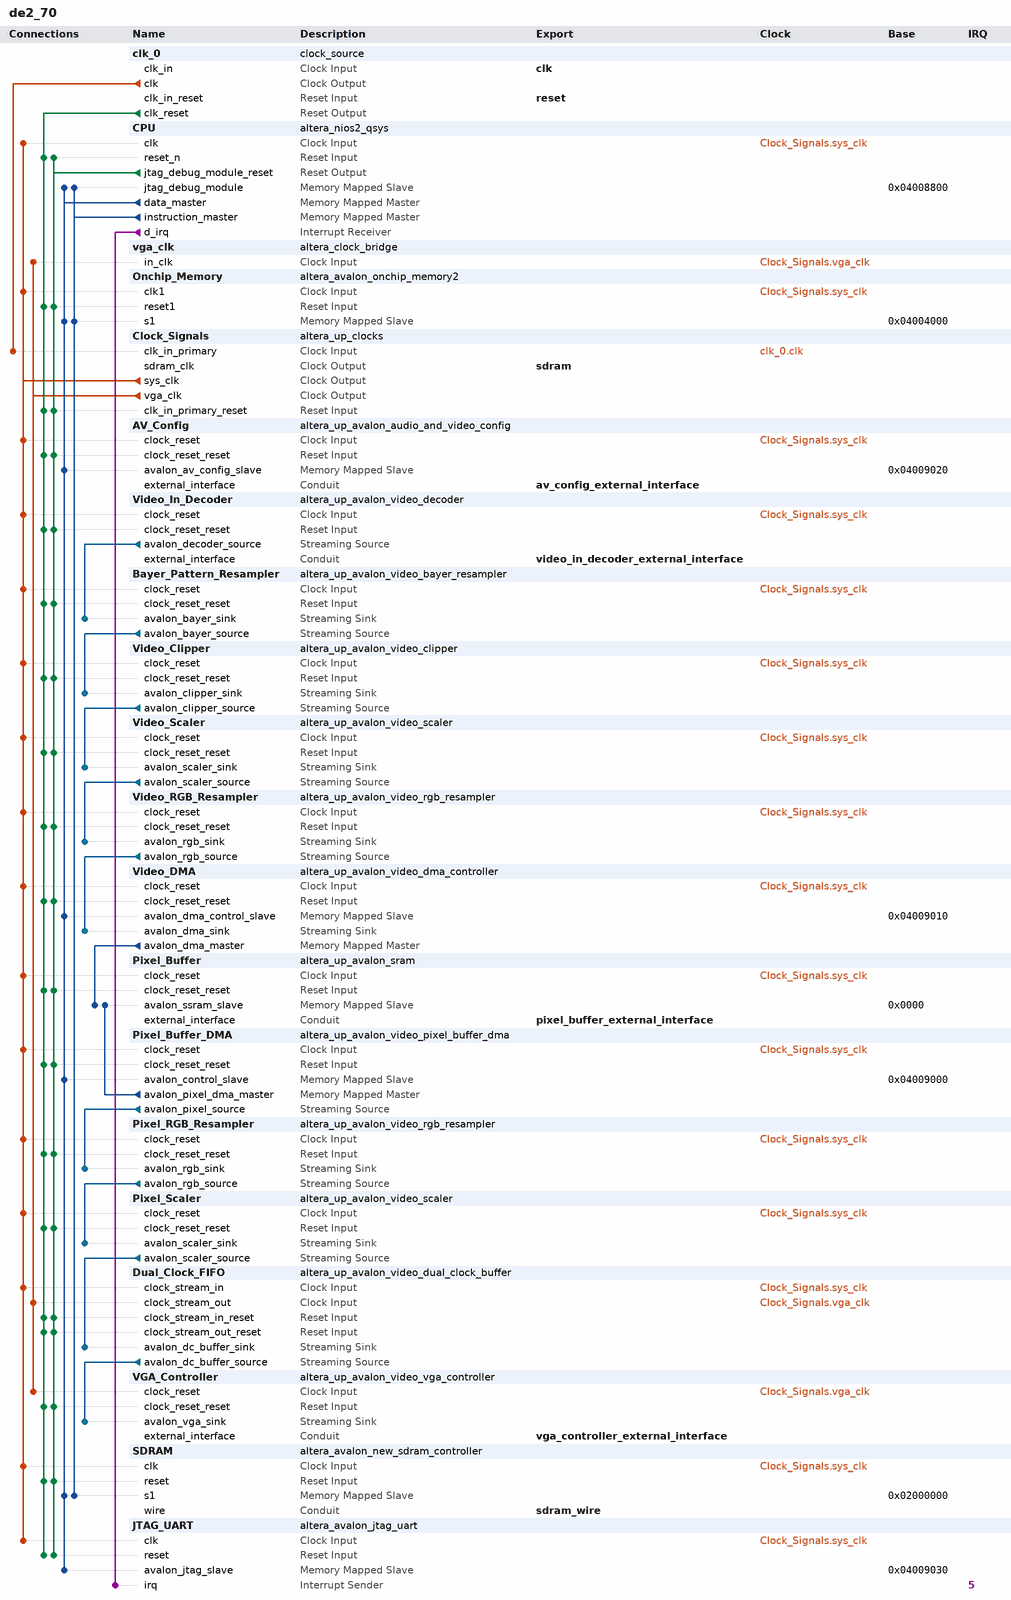
[diagram p0: system contents]
# Platform Designer (Qsys) system de2_70, Cyclone II EP2C70F896C6
# Parameters at their usual value, and those the tool derives, are not listed.
package require -exact qsys 13.0
create_system de2_70
set_project_property DEVICE_FAMILY {Cyclone II}
set_project_property DEVICE EP2C70F896C6

add_instance clk_0 clock_source 13.0
set_instance_parameter_value clk_0 clockFrequency 50000000

add_instance CPU altera_nios2_qsys 13.0
set_instance_parameter_value CPU resetSlave SDRAM.s1
set_instance_parameter_value CPU mmu_TLBMissExcSlave None
set_instance_parameter_value CPU exceptionSlave SDRAM.s1
set_instance_parameter_value CPU breakSlave CPU.jtag_debug_module
set_instance_parameter_value CPU impl Tiny
set_instance_parameter_value CPU icache_size 4096

add_instance vga_clk altera_clock_bridge 13.0
set_instance_parameter_value vga_clk DERIVED_CLOCK_RATE 25000000
set_instance_parameter_value vga_clk EXPLICIT_CLOCK_RATE 0

add_instance Onchip_Memory altera_avalon_onchip_memory2 13.0.1.99.2
set_instance_parameter_value Onchip_Memory dataWidth 32
set_instance_parameter_value Onchip_Memory dualPort false
set_instance_parameter_value Onchip_Memory initMemContent true
set_instance_parameter_value Onchip_Memory initializationFileName onchip_mem.hex
set_instance_parameter_value Onchip_Memory memorySize 16384

add_instance Clock_Signals altera_up_clocks 13.0
set_instance_parameter_value Clock_Signals board DE2-70
set_instance_parameter_value Clock_Signals vga_clk true
set_instance_parameter_value Clock_Signals audio_clk false
set_instance_parameter_value Clock_Signals audio_clk_freq 12.288

add_instance AV_Config altera_up_avalon_audio_and_video_config 13.0
set_instance_parameter_value AV_Config board DE2-70
set_instance_parameter_value AV_Config audio_in {Microphone to ADC}
set_instance_parameter_value AV_Config line_in_bypass false
set_instance_parameter_value AV_Config bit_length 24
set_instance_parameter_value AV_Config sampling_rate {48 kHz}

add_instance Video_In_Decoder altera_up_avalon_video_decoder 13.0
set_instance_parameter_value Video_In_Decoder video_source {5MP Daughtercard (THDB_D5M)}

add_instance Bayer_Pattern_Resampler altera_up_avalon_video_bayer_resampler 13.0
set_instance_parameter_value Bayer_Pattern_Resampler use_custom_format true
set_instance_parameter_value Bayer_Pattern_Resampler custom_width_in 2592
set_instance_parameter_value Bayer_Pattern_Resampler custom_height_in 1944

add_instance Video_Clipper altera_up_avalon_video_clipper 13.0
set_instance_parameter_value Video_Clipper width_in 1296
set_instance_parameter_value Video_Clipper height_in 972
set_instance_parameter_value Video_Clipper drop_left 8
set_instance_parameter_value Video_Clipper drop_right 8
set_instance_parameter_value Video_Clipper drop_top 6
set_instance_parameter_value Video_Clipper drop_bottom 6
set_instance_parameter_value Video_Clipper color_bits 8
set_instance_parameter_value Video_Clipper color_planes 3

add_instance Video_Scaler altera_up_avalon_video_scaler 13.0
set_instance_parameter_value Video_Scaler width_scaling 0.5
set_instance_parameter_value Video_Scaler height_scaling 0.25
set_instance_parameter_value Video_Scaler width_in 1280
set_instance_parameter_value Video_Scaler height_in 960
set_instance_parameter_value Video_Scaler color_bits 8
set_instance_parameter_value Video_Scaler color_planes 3

add_instance Video_RGB_Resampler altera_up_avalon_video_rgb_resampler 13.0
set_instance_parameter_value Video_RGB_Resampler input_type {24-bit RGB}
set_instance_parameter_value Video_RGB_Resampler output_type {16-bit RGB}
set_instance_parameter_value Video_RGB_Resampler alpha 1023

add_instance Video_DMA altera_up_avalon_video_dma_controller 13.0
set_instance_parameter_value Video_DMA mode {From Stream to Memory}
set_instance_parameter_value Video_DMA addr_mode X-Y
set_instance_parameter_value Video_DMA start_address 0
set_instance_parameter_value Video_DMA back_start_address 0
set_instance_parameter_value Video_DMA width 640
set_instance_parameter_value Video_DMA height 240
set_instance_parameter_value Video_DMA color_bits 16
set_instance_parameter_value Video_DMA color_planes 1
set_instance_parameter_value Video_DMA dma_enabled true

add_instance Pixel_Buffer altera_up_avalon_sram 13.0
set_instance_parameter_value Pixel_Buffer board DE2-70
set_instance_parameter_value Pixel_Buffer pixel_buffer true

add_instance Pixel_Buffer_DMA altera_up_avalon_video_pixel_buffer_dma 13.0
set_instance_parameter_value Pixel_Buffer_DMA addr_mode X-Y
set_instance_parameter_value Pixel_Buffer_DMA start_address 0
set_instance_parameter_value Pixel_Buffer_DMA back_start_address 0
set_instance_parameter_value Pixel_Buffer_DMA image_width 640
set_instance_parameter_value Pixel_Buffer_DMA image_height 240
set_instance_parameter_value Pixel_Buffer_DMA color_space {16-bit RGB}

add_instance Pixel_RGB_Resampler altera_up_avalon_video_rgb_resampler 13.0
set_instance_parameter_value Pixel_RGB_Resampler input_type {16-bit RGB}
set_instance_parameter_value Pixel_RGB_Resampler output_type {30-bit RGB}
set_instance_parameter_value Pixel_RGB_Resampler alpha 1023

add_instance Pixel_Scaler altera_up_avalon_video_scaler 13.0
set_instance_parameter_value Pixel_Scaler width_scaling 1
set_instance_parameter_value Pixel_Scaler height_scaling 2
set_instance_parameter_value Pixel_Scaler width_in 640
set_instance_parameter_value Pixel_Scaler color_bits 10
set_instance_parameter_value Pixel_Scaler color_planes 3

add_instance Dual_Clock_FIFO altera_up_avalon_video_dual_clock_buffer 13.0
set_instance_parameter_value Dual_Clock_FIFO color_bits 10

add_instance VGA_Controller altera_up_avalon_video_vga_controller 13.0
set_instance_parameter_value VGA_Controller board DE2-70

add_instance SDRAM altera_avalon_new_sdram_controller 13.0.1.99.2
set_instance_parameter_value SDRAM TAC 5.5
set_instance_parameter_value SDRAM TRCD 20.0
set_instance_parameter_value SDRAM TRP 20.0
set_instance_parameter_value SDRAM casLatency 3
set_instance_parameter_value SDRAM columnWidth 9
set_instance_parameter_value SDRAM dataWidth 16
set_instance_parameter_value SDRAM generateSimulationModel false
set_instance_parameter_value SDRAM model single_Micron_MT48LC4M32B2_7_chip
set_instance_parameter_value SDRAM numberOfBanks 4
set_instance_parameter_value SDRAM numberOfChipSelects 1
set_instance_parameter_value SDRAM powerUpDelay 200.0
set_instance_parameter_value SDRAM refreshPeriod 7.8125
set_instance_parameter_value SDRAM rowWidth 13

add_instance JTAG_UART altera_avalon_jtag_uart 13.0.1.99.2
set_instance_parameter_value JTAG_UART simInteractiveOptions NO_INTERACTIVE_WINDOWS

# connections
add_connection clk_0.clk Clock_Signals.clk_in_primary clock
add_connection Clock_Signals.sys_clk AV_Config.clock_reset clock
add_connection Clock_Signals.sys_clk Bayer_Pattern_Resampler.clock_reset clock
add_connection Clock_Signals.sys_clk CPU.clk clock
add_connection Clock_Signals.sys_clk Dual_Clock_FIFO.clock_stream_in clock
add_connection Clock_Signals.sys_clk JTAG_UART.clk clock
add_connection Clock_Signals.sys_clk Onchip_Memory.clk1 clock
add_connection Clock_Signals.sys_clk Pixel_Buffer.clock_reset clock
add_connection Clock_Signals.sys_clk Pixel_Buffer_DMA.clock_reset clock
add_connection Clock_Signals.sys_clk Pixel_RGB_Resampler.clock_reset clock
add_connection Clock_Signals.sys_clk Pixel_Scaler.clock_reset clock
add_connection Clock_Signals.sys_clk SDRAM.clk clock
add_connection Clock_Signals.sys_clk Video_Clipper.clock_reset clock
add_connection Clock_Signals.sys_clk Video_DMA.clock_reset clock
add_connection Clock_Signals.sys_clk Video_In_Decoder.clock_reset clock
add_connection Clock_Signals.sys_clk Video_RGB_Resampler.clock_reset clock
add_connection Clock_Signals.sys_clk Video_Scaler.clock_reset clock
add_connection Clock_Signals.vga_clk Dual_Clock_FIFO.clock_stream_out clock
add_connection Clock_Signals.vga_clk vga_clk.in_clk clock
add_connection Clock_Signals.vga_clk VGA_Controller.clock_reset clock
add_connection clk_0.clk_reset AV_Config.clock_reset_reset reset
add_connection clk_0.clk_reset Bayer_Pattern_Resampler.clock_reset_reset reset
add_connection clk_0.clk_reset Clock_Signals.clk_in_primary_reset reset
add_connection clk_0.clk_reset CPU.reset_n reset
add_connection clk_0.clk_reset Dual_Clock_FIFO.clock_stream_in_reset reset
add_connection clk_0.clk_reset Dual_Clock_FIFO.clock_stream_out_reset reset
add_connection clk_0.clk_reset JTAG_UART.reset reset
add_connection clk_0.clk_reset Onchip_Memory.reset1 reset
add_connection clk_0.clk_reset Pixel_Buffer.clock_reset_reset reset
add_connection clk_0.clk_reset Pixel_Buffer_DMA.clock_reset_reset reset
add_connection clk_0.clk_reset Pixel_RGB_Resampler.clock_reset_reset reset
add_connection clk_0.clk_reset Pixel_Scaler.clock_reset_reset reset
add_connection clk_0.clk_reset SDRAM.reset reset
add_connection clk_0.clk_reset VGA_Controller.clock_reset_reset reset
add_connection clk_0.clk_reset Video_Clipper.clock_reset_reset reset
add_connection clk_0.clk_reset Video_DMA.clock_reset_reset reset
add_connection clk_0.clk_reset Video_In_Decoder.clock_reset_reset reset
add_connection clk_0.clk_reset Video_RGB_Resampler.clock_reset_reset reset
add_connection clk_0.clk_reset Video_Scaler.clock_reset_reset reset
add_connection CPU.jtag_debug_module_reset AV_Config.clock_reset_reset reset
add_connection CPU.jtag_debug_module_reset Bayer_Pattern_Resampler.clock_reset_reset reset
add_connection CPU.jtag_debug_module_reset Clock_Signals.clk_in_primary_reset reset
add_connection CPU.jtag_debug_module_reset CPU.reset_n reset
add_connection CPU.jtag_debug_module_reset Dual_Clock_FIFO.clock_stream_in_reset reset
add_connection CPU.jtag_debug_module_reset Dual_Clock_FIFO.clock_stream_out_reset reset
add_connection CPU.jtag_debug_module_reset JTAG_UART.reset reset
add_connection CPU.jtag_debug_module_reset Onchip_Memory.reset1 reset
add_connection CPU.jtag_debug_module_reset Pixel_Buffer.clock_reset_reset reset
add_connection CPU.jtag_debug_module_reset Pixel_Buffer_DMA.clock_reset_reset reset
add_connection CPU.jtag_debug_module_reset Pixel_RGB_Resampler.clock_reset_reset reset
add_connection CPU.jtag_debug_module_reset Pixel_Scaler.clock_reset_reset reset
add_connection CPU.jtag_debug_module_reset SDRAM.reset reset
add_connection CPU.jtag_debug_module_reset VGA_Controller.clock_reset_reset reset
add_connection CPU.jtag_debug_module_reset Video_Clipper.clock_reset_reset reset
add_connection CPU.jtag_debug_module_reset Video_DMA.clock_reset_reset reset
add_connection CPU.jtag_debug_module_reset Video_In_Decoder.clock_reset_reset reset
add_connection CPU.jtag_debug_module_reset Video_RGB_Resampler.clock_reset_reset reset
add_connection CPU.jtag_debug_module_reset Video_Scaler.clock_reset_reset reset
add_connection CPU.data_master AV_Config.avalon_av_config_slave avalon
set_connection_parameter_value CPU.data_master/AV_Config.avalon_av_config_slave baseAddress 0x04009020
add_connection CPU.data_master CPU.jtag_debug_module avalon
set_connection_parameter_value CPU.data_master/CPU.jtag_debug_module baseAddress 0x04008800
add_connection CPU.data_master JTAG_UART.avalon_jtag_slave avalon
set_connection_parameter_value CPU.data_master/JTAG_UART.avalon_jtag_slave baseAddress 0x04009030
add_connection CPU.data_master Onchip_Memory.s1 avalon
set_connection_parameter_value CPU.data_master/Onchip_Memory.s1 baseAddress 0x04004000
add_connection CPU.data_master Pixel_Buffer_DMA.avalon_control_slave avalon
set_connection_parameter_value CPU.data_master/Pixel_Buffer_DMA.avalon_control_slave baseAddress 0x04009000
add_connection CPU.data_master SDRAM.s1 avalon
set_connection_parameter_value CPU.data_master/SDRAM.s1 baseAddress 0x02000000
add_connection CPU.data_master Video_DMA.avalon_dma_control_slave avalon
set_connection_parameter_value CPU.data_master/Video_DMA.avalon_dma_control_slave baseAddress 0x04009010
add_connection CPU.instruction_master CPU.jtag_debug_module avalon
set_connection_parameter_value CPU.instruction_master/CPU.jtag_debug_module baseAddress 0x04008800
add_connection CPU.instruction_master Onchip_Memory.s1 avalon
set_connection_parameter_value CPU.instruction_master/Onchip_Memory.s1 baseAddress 0x04004000
add_connection CPU.instruction_master SDRAM.s1 avalon
set_connection_parameter_value CPU.instruction_master/SDRAM.s1 baseAddress 0x02000000
add_connection Pixel_Buffer_DMA.avalon_pixel_dma_master Pixel_Buffer.avalon_ssram_slave avalon
set_connection_parameter_value Pixel_Buffer_DMA.avalon_pixel_dma_master/Pixel_Buffer.avalon_ssram_slave baseAddress 0x0000
add_connection Video_DMA.avalon_dma_master Pixel_Buffer.avalon_ssram_slave avalon
set_connection_parameter_value Video_DMA.avalon_dma_master/Pixel_Buffer.avalon_ssram_slave baseAddress 0x0000
add_connection Bayer_Pattern_Resampler.avalon_bayer_source Video_Clipper.avalon_clipper_sink avalon_streaming
add_connection Dual_Clock_FIFO.avalon_dc_buffer_source VGA_Controller.avalon_vga_sink avalon_streaming
add_connection Pixel_Buffer_DMA.avalon_pixel_source Pixel_RGB_Resampler.avalon_rgb_sink avalon_streaming
add_connection Pixel_RGB_Resampler.avalon_rgb_source Pixel_Scaler.avalon_scaler_sink avalon_streaming
add_connection Pixel_Scaler.avalon_scaler_source Dual_Clock_FIFO.avalon_dc_buffer_sink avalon_streaming
add_connection Video_Clipper.avalon_clipper_source Video_Scaler.avalon_scaler_sink avalon_streaming
add_connection Video_In_Decoder.avalon_decoder_source Bayer_Pattern_Resampler.avalon_bayer_sink avalon_streaming
add_connection Video_RGB_Resampler.avalon_rgb_source Video_DMA.avalon_dma_sink avalon_streaming
add_connection Video_Scaler.avalon_scaler_source Video_RGB_Resampler.avalon_rgb_sink avalon_streaming
add_connection CPU.d_irq JTAG_UART.irq interrupt
set_connection_parameter_value CPU.d_irq/JTAG_UART.irq irqNumber 5

# exported interfaces
add_interface clk clock sink
set_interface_property clk EXPORT_OF clk_0.clk_in
add_interface reset reset sink
set_interface_property reset EXPORT_OF clk_0.clk_in_reset
add_interface sdram clock source
set_interface_property sdram EXPORT_OF Clock_Signals.sdram_clk
add_interface av_config_external_interface conduit end
set_interface_property av_config_external_interface EXPORT_OF AV_Config.external_interface
add_interface video_in_decoder_external_interface conduit end
set_interface_property video_in_decoder_external_interface EXPORT_OF Video_In_Decoder.external_interface
add_interface pixel_buffer_external_interface conduit end
set_interface_property pixel_buffer_external_interface EXPORT_OF Pixel_Buffer.external_interface
add_interface vga_controller_external_interface conduit end
set_interface_property vga_controller_external_interface EXPORT_OF VGA_Controller.external_interface
add_interface sdram_wire conduit end
set_interface_property sdram_wire EXPORT_OF SDRAM.wire

set_interconnect_requirement {$system} qsys_mm.clockCrossingAdapter HANDSHAKE
set_interconnect_requirement {$system} qsys_mm.maxAdditionalLatency 1

save_system de2_70.qsys
